# Altium schematic sheet ULED.SchDoc
size 76 x 50 mm
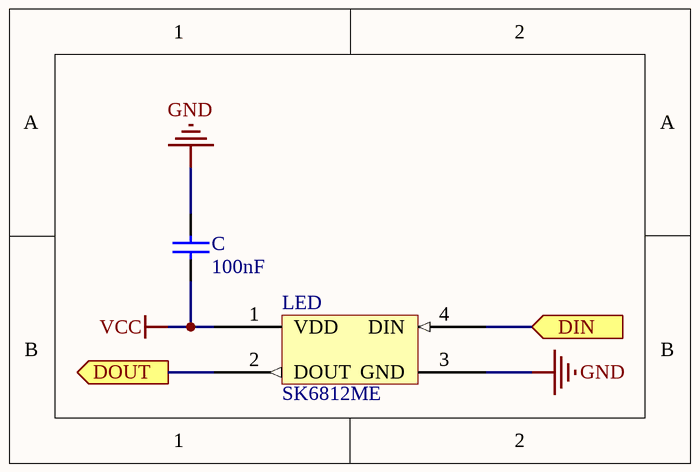
[diagram p0: ULED.SchDoc]

## Parts
C  100nF  [CAPC1005X55X30LL05T10]
LED  SK6812ME  [SK6812ME]

## Ports
DIN (in), DOUT (out)

## Nets
GND: C.2 LED.3(GND)
VCC: C.1 LED.1(VDD)
DIN: LED.4(DIN) ; port DIN
DOUT: LED.2(DOUT) ; port DOUT

## Library data of the parts
C = CMP-0001-00074-2: Manufacturer: Kemet; Part Number: C0402C104K4RACTU
LED = SK6812: Individually Adressable SK6812 Mini-E 3528 LED